# Altium schematic sheet PT_to_ADCs.SchDoc
size A
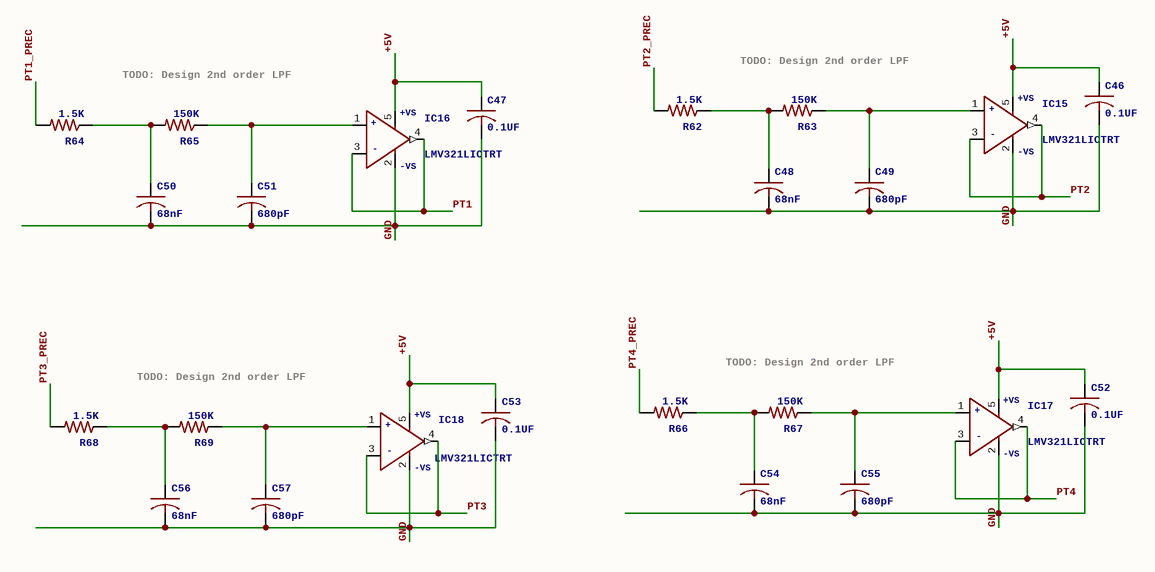
[diagram p0: PT_to_ADCs.SchDoc]

## Parts
C46  0.1UF  [CAPCP2012X06N]
C47  0.1UF  [CAPCP2012X06N]
C48  68nF  [CAPCP2012X06N]
C49  680pF  [CAPCP2012X06N]
C50  68nF  [CAPCP2012X06N]
C51  680pF  [CAPCP2012X06N]
C52  0.1UF  [CAPCP2012X06N]
C53  0.1UF  [CAPCP2012X06N]
C54  68nF  [CAPCP2012X06N]
C55  680pF  [CAPCP2012X06N]
C56  68nF  [CAPCP2012X06N]
C57  680pF  [CAPCP2012X06N]
IC15  LMV321LICTRT  [SOT95P245X110-5N]
IC16  LMV321LICTRT  [SOT95P245X110-5N]
IC17  LMV321LICTRT  [SOT95P245X110-5N]
IC18  LMV321LICTRT  [SOT95P245X110-5N]
R62  1.5K  [RESC_0805_2012]
R63  150K  [RESC_0805_2012]
R64  1.5K  [RESC_0805_2012]
R65  150K  [RESC_0805_2012]
R66  1.5K  [RESC_0805_2012]
R67  150K  [RESC_0805_2012]
R68  1.5K  [RESC_0805_2012]
R69  150K  [RESC_0805_2012]

## Nets
+5V: C46.1 C47.1 C52.1 C53.1 IC15.5(+VS) IC16.5(+VS) IC17.5(+VS) IC18.5(+VS)
GND: C46.2 C47.2 C48.2 C49.2 C50.2 C51.2 C52.2 C53.2 C54.2 C55.2 C56.2 C57.2 IC15.2(-VS) IC16.2(-VS) IC17.2(-VS) IC18.2(-VS)
PT1: IC16.3(IN-) IC16.4(OUT)
PT1_PREC: R64.2
PT2: IC15.3(IN-) IC15.4(OUT)
PT2_PREC: R62.2
PT3: IC18.3(IN-) IC18.4(OUT)
PT3_PREC: R68.2
PT4: IC17.3(IN-) IC17.4(OUT)
PT4_PREC: R66.2
NetC48_1: C48.1 R62.1 R63.2
NetC49_1: C49.1 IC15.1(IN+) R63.1
NetC50_1: C50.1 R64.1 R65.2
NetC51_1: C51.1 IC16.1(IN+) R65.1
NetC54_1: C54.1 R66.1 R67.2
NetC55_1: C55.1 IC17.1(IN+) R67.1
NetC56_1: C56.1 R68.1 R69.2
NetC57_1: C57.1 IC18.1(IN+) R69.1

## Notes on the sheet
- TODO: Design 2nd order LPF

## Library data of the parts
C46-C57 = C-USC0805: CAPACITOR, American symbol; GateName_1: G$1; SymbolName_1: C-US; DeviceName: C0805; LibraryName: rcl; DeviceSetName: C-US; SPICEPREFIX: C
IC15-IC18 = LMV321LICTRT: High Performance, 145 MHz FastFET Op AmpsSource: http://www.analog.com/static/imported-files/data_sheets/AD8065_8066.pdf; MPN: AD8065ARTZ-REEL7; GateName_1: G$; SymbolName_1: OP+-VS; DeviceName: RT; MF: ALTERA CORPORATION; LibraryName: st-microelectronics-extra; DeviceSetName: LMV321LICT; OC_FARNELL: 1464845; OC_NEWARK: 59K6316; +: +; -: -; +VS: +VS; -VS: -VS
R62-R69 = R-US_R0805: RESISTOR, American symbol; GateName_1: G$1; SymbolName_1: R-US; DeviceName: R0805; DeviceSetName: R-US_; LibraryName: rcl